# Altium project LED_Music.PrjPcb
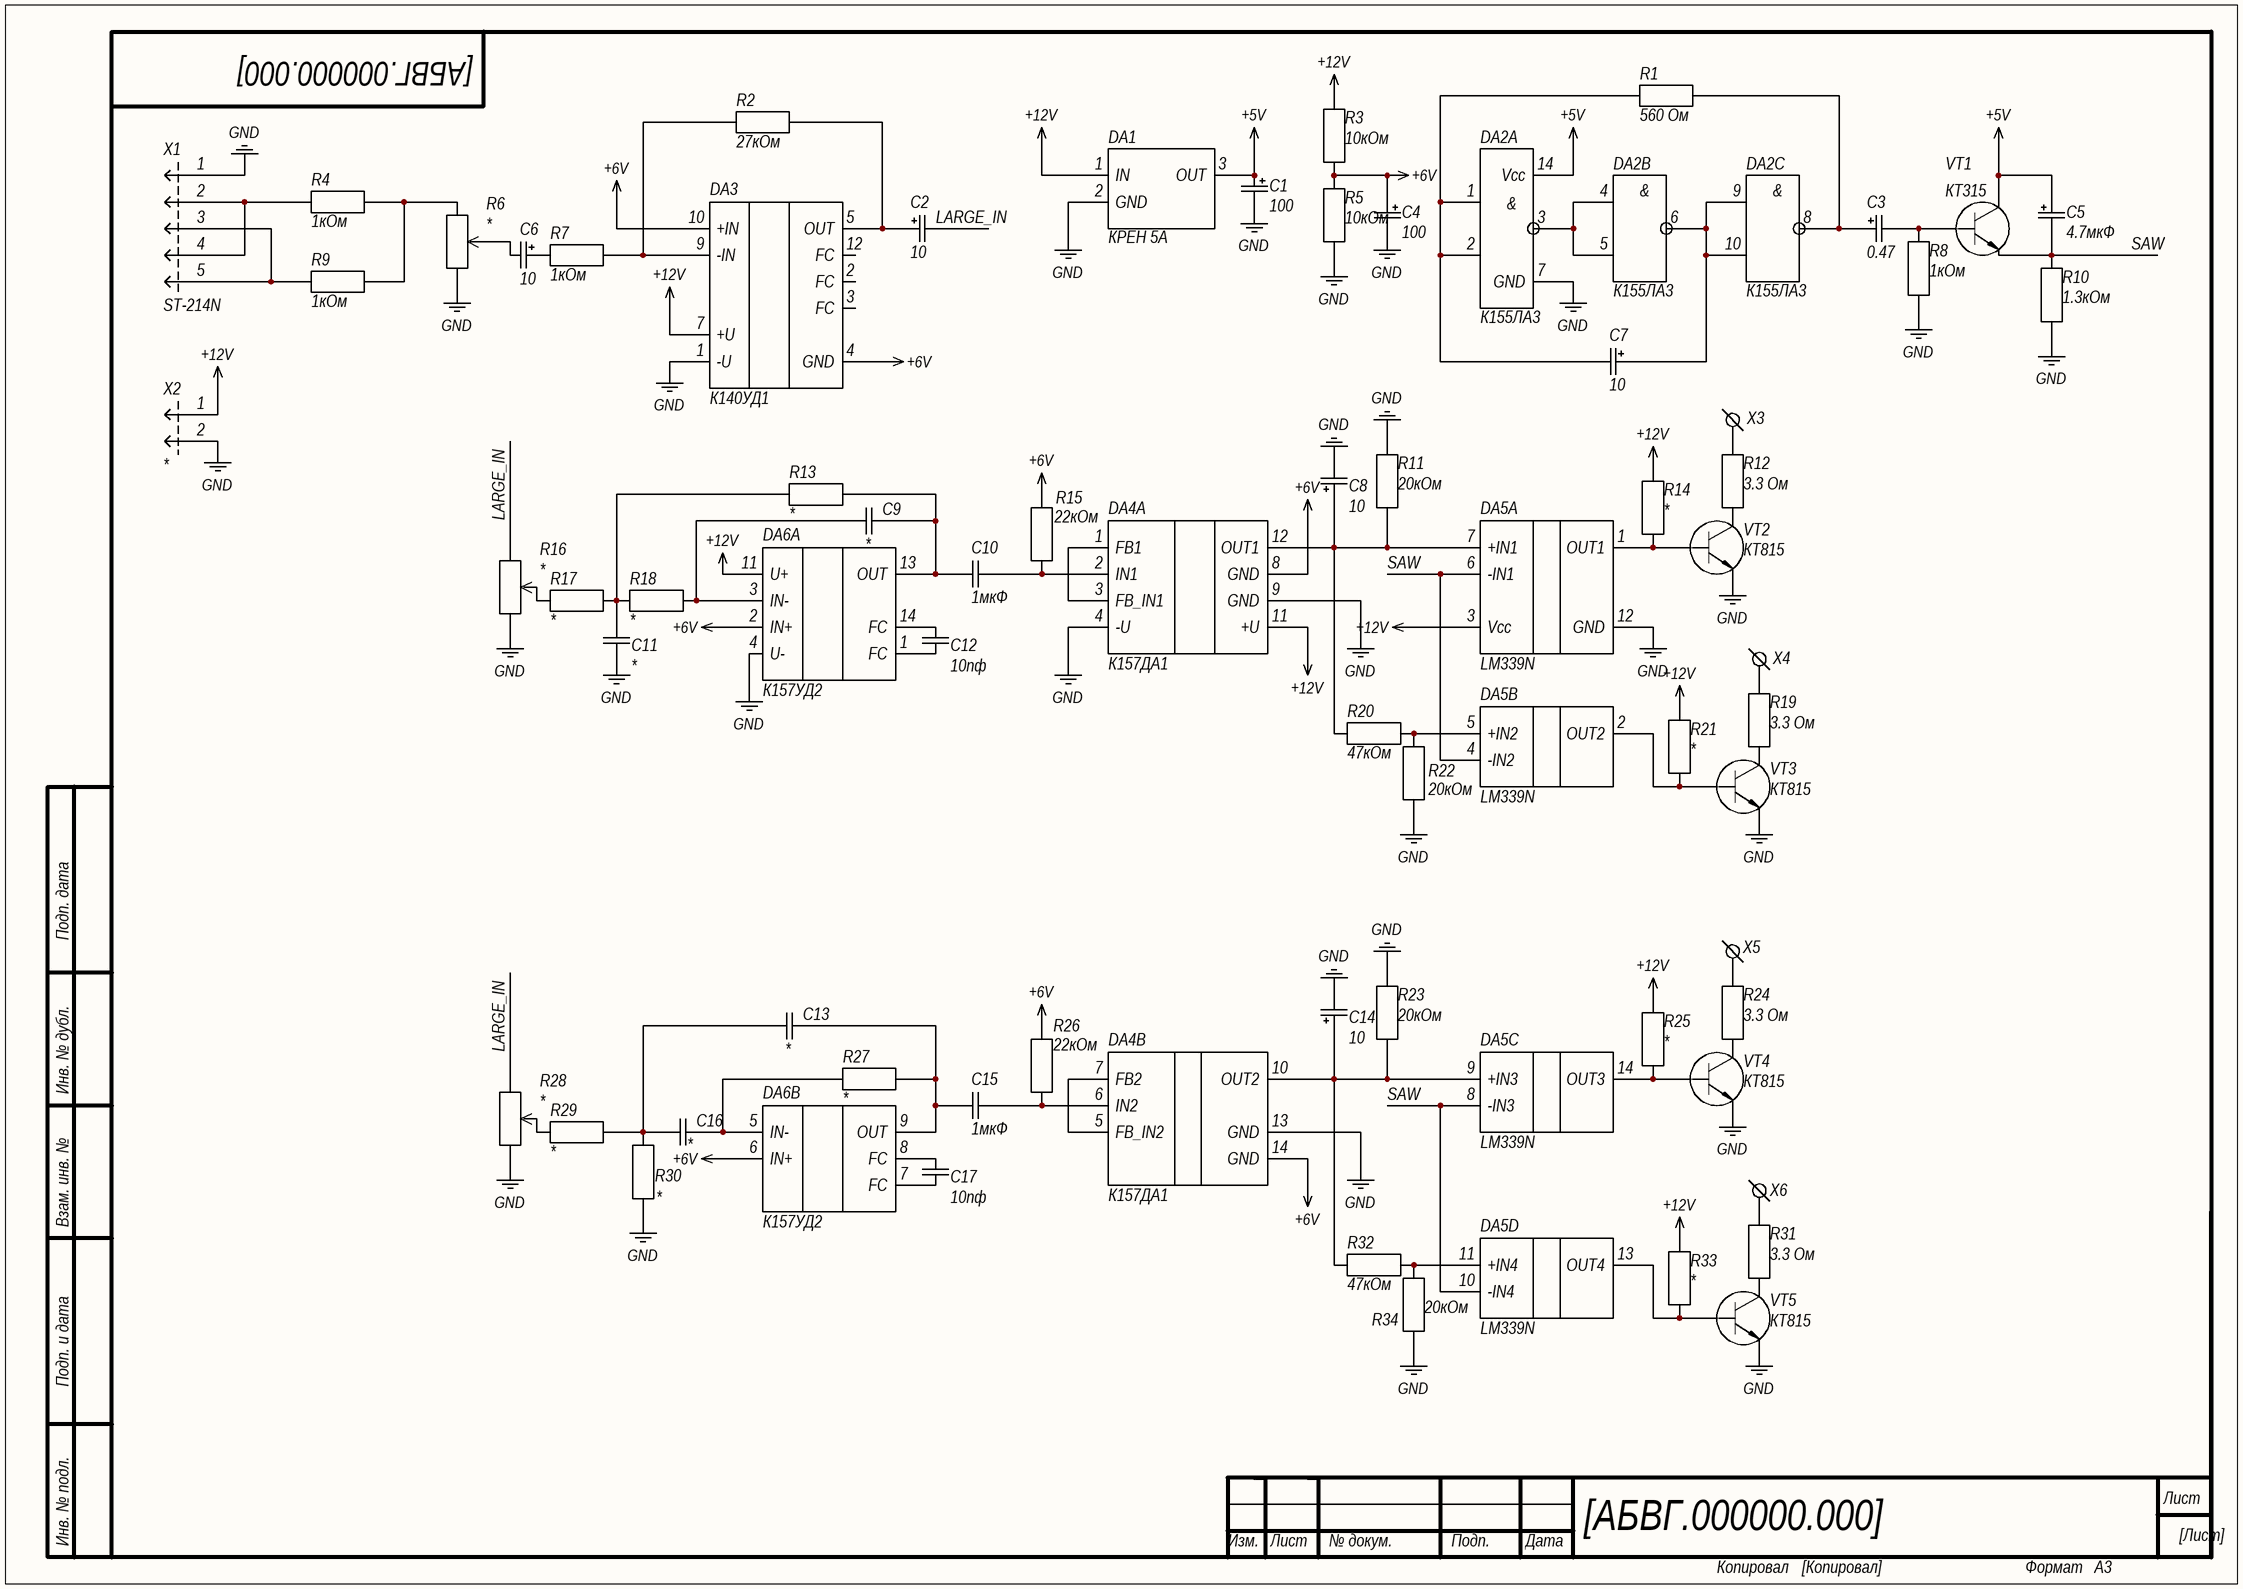
[diagram p0: Sheet1.SchDoc]
2 sheets, 113 parts. Net scope: global (net labels, ports and power ports of the same name join across sheets).
Board file: PCB1.PcbDoc
Sheets:
  Sheet1.SchDoc
  Sheet2.SchDoc

## Sheet Sheet1.SchDoc: [Название]
size 420 x 297 mm; ApprovedBy: [Утвердил]; CheckedBy: [Пров.]; Author: [Разраб.]; CompanyName: [Компания]; DocumentNumber: [АБВГ.000000.000]; SheetNumber: [Лист]; SheetTotal: [Листов]; ProcessInspection: [Т. контр.]; NormInspection: [Н. контр.]; firstReference: [Перв. применение]; CopiedBy: [Копировал]

### Parts
C1  100  [C 3.5mm]
C2  10  [C 3.5mm]
C3  0.47  [C 3.5mm]
C4  100  [C 3.5mm]
C5  4.7мкФ  [C 3.5mm]
C6  10  [C 3.5mm]
C7  10  [C 3.5mm]
C8  10  [C 3.5mm]
C9  *  [C 15mm]
C10  1мкФ  [C 10mm]
C11  *  [C 15mm]
C12  10пф  [C 10mm]
C13  *  [C 15mm]
C14  10  [C 3.5mm]
C15  1мкФ  [C 10mm]
C16  *  [C 15mm]
C17  10пф  [C 10mm]
DA1  КРЕН 5А  [TO-220]
DA2  К155ЛА3  [14-LEAD DIP]  (parts A,B,C of 4)
DA3  К140УД1  [301.12-1]
DA4  К157ДА1  [14-LEAD DIP]  (parts A,B of 2)
DA5  LM339N  [14-LEAD DIP]  (parts A,B,C,D of 4)
DA6  К157УД2  [14-LEAD DIP]  (parts A,B of 2)
R1  560 Ом  [R 10mm]
R2  27кОм  [R 10mm]
R3  10кОм  [R 10mm]
R4  1кОм  [R 10mm]
R5  10кОм  [R 10mm]
R6  *  [OFF BOARD RESISTOR]
R7  1кОм  [R 10mm]
R8  1кОм  [R 10mm]
R9  1кОм  [R 10mm]
R10  1.3кОм  [R 10mm]
R11  20кОм  [R 10mm]
R12  3.3 Ом  [R 10mm]
R13  *  [R 10mm]
R14  *  [R 10mm]
R15  22кОм  [R 10mm]
R16  *  [OFF BOARD RESISTOR]
R17  *  [R 10mm]
R18  *  [R 10mm]
R19  3.3 Ом  [R 10mm]
R20  47кОм  [R 10mm]
R21  *  [R 10mm]
R22  20кОм  [R 10mm]
R23  20кОм  [R 10mm]
R24  3.3 Ом  [R 10mm]
R25  *  [R 10mm]
R26  22кОм  [R 10mm]
R27  *  [R 10mm]
R28  *  [OFF BOARD RESISTOR]
R29  *  [R 10mm]
R30  *  [R 10mm]
R31  3.3 Ом  [R 10mm]
R32  47кОм  [R 10mm]
R33  *  [R 10mm]
R34  20кОм  [R 10mm]
VT1  КТ315  [KT-13]
VT2  КТ815  [KT-27]
VT3  КТ815  [KT-27]
VT4  КТ815  [KT-27]
VT5  КТ815  [KT-27]
X1  ST-214N  [ST-214N]
X2  *  [PLS-2]
X3  (no value)  [TP 1,4mm]
X4  (no value)  [TP 1,4mm]
X5  (no value)  [TP 1,4mm]
X6  (no value)  [TP 1,4mm]

### Nets
+5V: C1.1 C5.1 DA1.3(OUT) DA2.14(Vcc) VT1.3
+6V: C4.1 DA3.4(GND) DA3.10(+IN) DA4.8(GND) DA4.14(GND) DA6.2(IN+) DA6.6(IN+) R3.1 R5.2 R15.2 R26.2
+12V: DA1.1(IN) DA3.7(+U) DA4.11(+U) DA5.3(Vcc) DA6.11(U+) R3.2 R14.2 R21.2 R25.2 R33.2 X2.1
GND: C1.2 C4.2 C8.2 C11.1 C14.2 DA1.2(GND) DA2.7(GND) DA3.1(-U) DA4.4(-U) DA4.9(GND) DA4.13(GND) DA5.12(GND) DA6.4(U-) R5.1 R6.1 R8.1 R10.1 R11.2 R16.2 R22.1 R23.2 R28.2 R30.1 R34.1 VT2.2 VT3.2 VT4.2 VT5.2 X1.1 X2.2
LARGE_IN: C2.2 R16.1 R28.1
SAW: C5.2 DA5.4(-IN2) DA5.6(-IN1) DA5.8(-IN3) DA5.10(-IN4) R10.2 VT1.2
NetC2_1: C2.1 DA3.5(OUT) R2.2
NetC3_1: C3.1 DA2.8 R1.2
NetC3_2: C3.2 R8.2 VT1.1
NetC6_1: C6.1 R7.1
NetC6_2: C6.2 R6.3
NetC7_1: C7.1 DA2.6 DA2.9 DA2.10
NetC7_2: C7.2 DA2.1 DA2.2 R1.1
NetC8_1: C8.1 DA4.12(OUT1) DA5.7(+IN1) R11.1 R20.1
NetC9_1: C9.1 DA6.3(IN-) R18.2
NetC9_2: C9.2 C10.1 DA6.13(OUT) R13.1
NetC10_2: C10.2 DA4.2(IN1) R15.1
NetC11_2: C11.2 R13.2 R17.2 R18.1
NetC12_1: C12.1 DA6.1(FC)
NetC12_2: C12.2 DA6.14(FC)
NetC13_1: C13.1 C16.1 R29.2 R30.2
NetC13_2: C13.2 C15.1 DA6.9(OUT) R27.1
NetC14_1: C14.1 DA4.10(OUT2) DA5.9(+IN3) R23.1 R32.1
NetC15_2: C15.2 DA4.6(IN2) R26.1
NetC16_2: C16.2 DA6.5(IN-) R27.2
NetC17_1: C17.1 DA6.7(FC)
NetC17_2: C17.2 DA6.8(FC)
NetDA2_3: DA2.3 DA2.4 DA2.5
NetDA3_9: DA3.9(-IN) R2.1 R7.2
NetDA4_1: DA4.1(FB1) DA4.3(FB_IN1)
NetDA4_5: DA4.5(FB_IN2) DA4.7(FB2)
NetDA5_1: DA5.1(OUT1) R14.1 VT2.1
NetDA5_2: DA5.2(OUT2) R21.1 VT3.1
NetDA5_5: DA5.5(+IN2) R20.2 R22.2
NetDA5_11: DA5.11(+IN4) R32.2 R34.2
NetDA5_13: DA5.13(OUT4) R33.1 VT5.1
NetDA5_14: DA5.14(OUT3) R25.1 VT4.1
NetR4_1: R4.1 X1.2 X1.4
NetR4_2: R4.2 R6.2 R9.2
NetR9_1: R9.1 X1.3 X1.5
NetR12_1: R12.1 VT2.3
NetR12_2: R12.2 X3.1
NetR16_3: R16.3 R17.1
NetR19_1: R19.1 VT3.3
NetR19_2: R19.2 X4.1
NetR24_1: R24.1 VT4.3
NetR24_2: R24.2 X5.1
NetR28_3: R28.3 R29.1
NetR31_1: R31.1 VT5.3
NetR31_2: R31.2 X6.1

Not connected (* = marked no-connect by the designer): DA3 2(FC) 3(FC) 12(FC)

### Notes on the sheet
- Подп. дата
- Инв. № дубл.
- Взам. инв. №
- Подп. и дата
- Инв. № подл.
- Лист
- Изм.
- № докум.
- Подп.
- Дата
- Копировал
- Формат
- А3
- (in symbol К155ЛА3, part A) &
- (in symbol К155ЛА3, part B) &
- (in symbol К155ЛА3, part C) &

### Library data of the parts
C1-C8 C14 = Capacitor Pol: Value1: *; Manufacturer: *; ТУ: *; Url: *
  C1 C4: Value: 100
  C2 C6-C8 C14: Value: 10
  C3: Value: 0.47
  C5: Value: 4.7мкФ
C9-C13 C15-C17 = Capacitor: Value1: *; ТУ: *; Url: *
  C9 C11 C13 C16: Value: *
  C10 C15: Value: 1мкФ
  C12 C17: Value: 10пф
DA1 = KREN 5A: value: КРЕН 5А
R1-R5 R7-R15 R17-R27 R29-R34 = Resistor: Value1: *; ТУ: *; Manufacturer: *; Url: *
  R1: Value: 560 Ом
  R2: Value: 27кОм
  R3 R5: Value: 10кОм
  R4 R7-R9: Value: 1кОм
  R10: Value: 1.3кОм
  R11 R22 R23 R34: Value: 20кОм
  R12 R19 R24 R31: Value: 3.3 Ом
  R13 R14 R17 R18 R21 R25 R27 R29 R30 R33: Value: *
  R15 R26: Value: 22кОм
  R20 R32: Value: 47кОм
R6 R16 R28 = ResistorVar: Value: *; Value1: *; ТУ: *; Url: *; Manufacturer: *
VT1-VT5 = NPN: Transistor; Value1: *; ТУ: *; Manufacturer: *; Url: *
  VT1: Value: КТ315
  VT2-VT5: Value: КТ815
X1 = ST-214N: Connector; value: ST-214N
X2 = Connector 2-pin: Connector; Manufacturer: *; PartNumber: *; Value: *; Value1: *
X3-X6 = TP
DA2 = К155ЛА3: value: К155ЛА3
DA3 = К140УД1: value: К140УД1
DA4 = К157ДА1: value: К157ДА1
DA5 = LM339N: value: LM339N
DA6 = К157УД2: value: К157УД2

## Sheet Sheet2.SchDoc: [Название]
size 420 x 297 mm; ApprovedBy: [Утвердил]; CheckedBy: [Пров.]; Author: [Разраб.]; CompanyName: [Компания]; DocumentNumber: [АБВГ.000000.000]; SheetNumber: [Лист]; SheetTotal: [Листов]; ProcessInspection: [Т. контр.]; NormInspection: [Н. контр.]; firstReference: [Перв. применение]; CopiedBy: [Копировал]
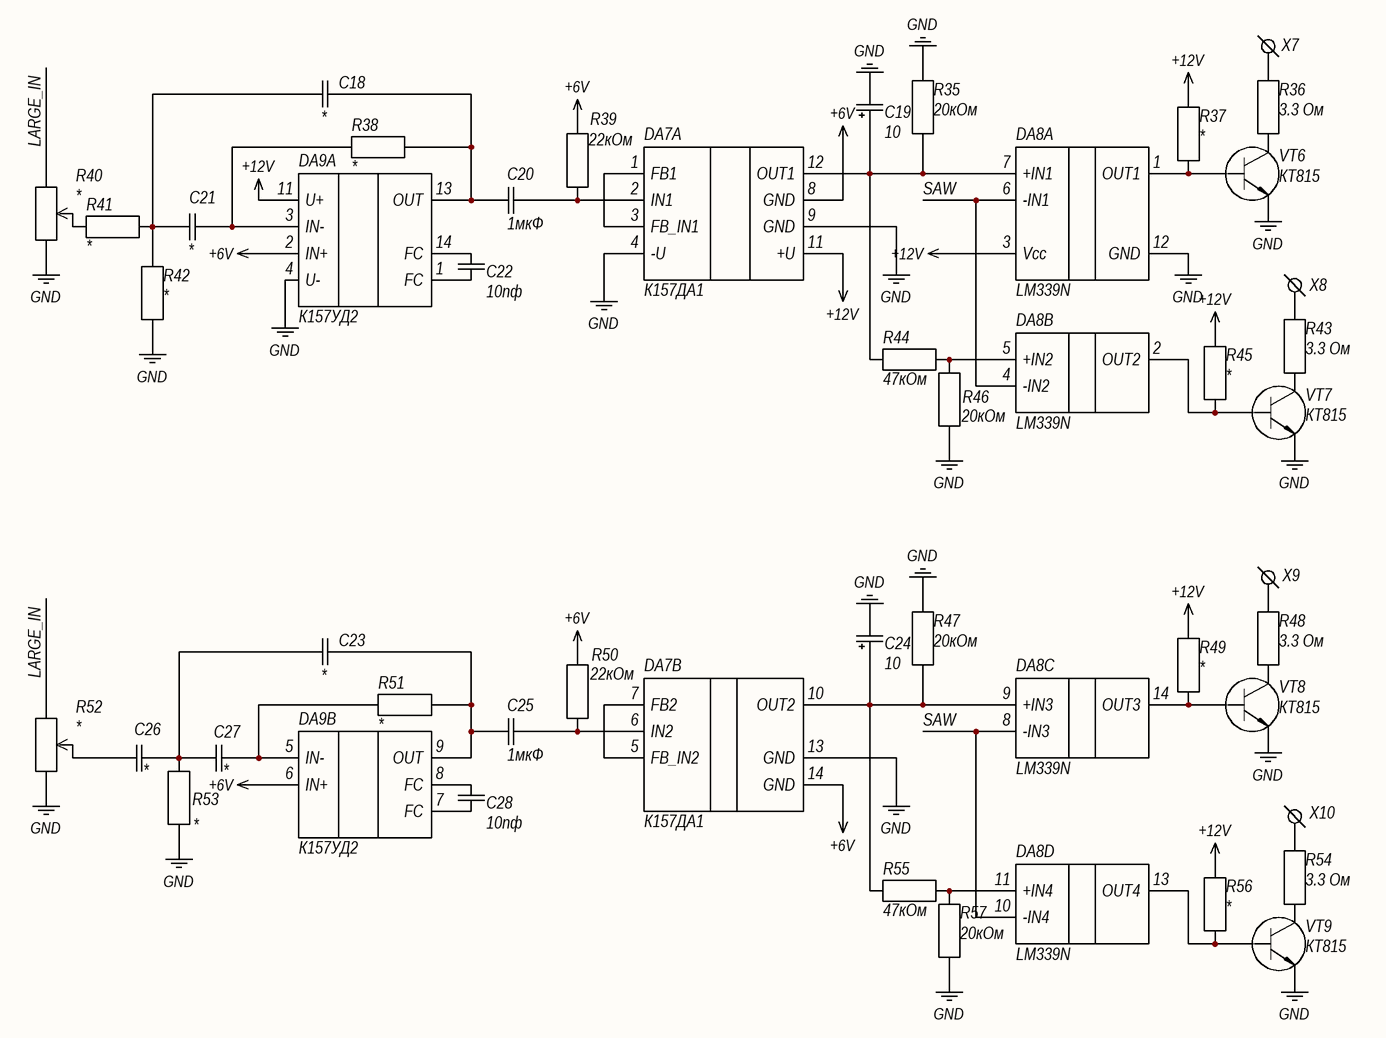
[diagram p1: Sheet2.SchDoc]

### Parts
C18  *  [C 15mm]
C19  10  [C 3.5mm]
C20  1мкФ  [C 10mm]
C21  *  [C 15mm]
C22  10пф  [C 10mm]
C23  *  [C 15mm]
C24  10  [C 3.5mm]
C25  1мкФ  [C 10mm]
C26  *  [C 15mm]
C27  *  [C 15mm]
C28  10пф  [C 10mm]
DA7  К157ДА1  [14-LEAD DIP]  (parts A,B of 2)
DA8  LM339N  [14-LEAD DIP]  (parts A,B,C,D of 4)
DA9  К157УД2  [14-LEAD DIP]  (parts A,B of 2)
R35  20кОм  [R 10mm]
R36  3.3 Ом  [R 10mm]
R37  *  [R 10mm]
R38  *  [R 10mm]
R39  22кОм  [R 10mm]
R40  *  [OFF BOARD RESISTOR]
R41  *  [R 10mm]
R42  *  [R 10mm]
R43  3.3 Ом  [R 10mm]
R44  47кОм  [R 10mm]
R45  *  [R 10mm]
R46  20кОм  [R 10mm]
R47  20кОм  [R 10mm]
R48  3.3 Ом  [R 10mm]
R49  *  [R 10mm]
R50  22кОм  [R 10mm]
R51  *  [R 10mm]
R52  *  [OFF BOARD RESISTOR]
R53  *  [R 10mm]
R54  3.3 Ом  [R 10mm]
R55  47кОм  [R 10mm]
R56  *  [R 10mm]
R57  20кОм  [R 10mm]
VT6  КТ815  [KT-27]
VT7  КТ815  [KT-27]
VT8  КТ815  [KT-27]
VT9  КТ815  [KT-27]
X7  (no value)  [TP 1,4mm]
X8  (no value)  [TP 1,4mm]
X9  (no value)  [TP 1,4mm]
X10  (no value)  [TP 1,4mm]

### Nets
+6V: DA7.8(GND) DA7.14(GND) DA9.2(IN+) DA9.6(IN+) R39.2 R50.2
+12V: DA7.11(+U) DA8.3(Vcc) DA9.11(U+) R37.2 R45.2 R49.2 R56.2
GND: C19.2 C24.2 DA7.4(-U) DA7.9(GND) DA7.13(GND) DA8.12(GND) DA9.4(U-) R35.2 R40.2 R42.1 R46.1 R47.2 R52.2 R53.1 R57.1 VT6.2 VT7.2 VT8.2 VT9.2
LARGE_IN: R40.1 R52.1
SAW: DA8.4(-IN2) DA8.6(-IN1) DA8.8(-IN3) DA8.10(-IN4)
NetC18_1: C18.1 C21.1 R41.2 R42.2
NetC18_2: C18.2 C20.1 DA9.13(OUT) R38.1
NetC19_1: C19.1 DA7.12(OUT1) DA8.7(+IN1) R35.1 R44.1
NetC20_2: C20.2 DA7.2(IN1) R39.1
NetC21_2: C21.2 DA9.3(IN-) R38.2
NetC22_1: C22.1 DA9.1(FC)
NetC22_2: C22.2 DA9.14(FC)
NetC23_1: C23.1 C26.2 C27.1 R53.2
NetC23_2: C23.2 C25.1 DA9.9(OUT) R51.1
NetC24_1: C24.1 DA7.10(OUT2) DA8.9(+IN3) R47.1 R55.1
NetC25_2: C25.2 DA7.6(IN2) R50.1
NetC26_1: C26.1 R52.3
NetC27_2: C27.2 DA9.5(IN-) R51.2
NetC28_1: C28.1 DA9.7(FC)
NetC28_2: C28.2 DA9.8(FC)
NetDA7_1: DA7.1(FB1) DA7.3(FB_IN1)
NetDA7_5: DA7.5(FB_IN2) DA7.7(FB2)
NetDA8_1: DA8.1(OUT1) R37.1 VT6.1
NetDA8_2: DA8.2(OUT2) R45.1 VT7.1
NetDA8_5: DA8.5(+IN2) R44.2 R46.2
NetDA8_11: DA8.11(+IN4) R55.2 R57.2
NetDA8_13: DA8.13(OUT4) R56.1 VT9.1
NetDA8_14: DA8.14(OUT3) R49.1 VT8.1
NetR36_1: R36.1 VT6.3
NetR36_2: R36.2 X7.1
NetR40_3: R40.3 R41.1
NetR43_1: R43.1 VT7.3
NetR43_2: R43.2 X8.1
NetR48_1: R48.1 VT8.3
NetR48_2: R48.2 X9.1
NetR54_1: R54.1 VT9.3
NetR54_2: R54.2 X10.1

### Notes on the sheet
- Подп. дата
- Инв. № дубл.
- Взам. инв. №
- Подп. и дата
- Инв. № подл.
- Лист
- Изм.
- № докум.
- Подп.
- Дата
- Копировал
- Формат
- А3

### Library data of the parts
C18 C20-C23 C25-C28 = Capacitor: Value1: *; ТУ: *; Url: *
  C18 C21 C23 C26 C27: Value: *
  C20 C25: Value: 1мкФ
  C22 C28: Value: 10пф
C19 C24 = Capacitor Pol: Value: 10; Value1: *; Manufacturer: *; ТУ: *; Url: *
R35-R39 R41-R51 R53-R57 = Resistor: Value1: *; ТУ: *; Manufacturer: *; Url: *
  R35 R46 R47 R57: Value: 20кОм
  R36 R43 R48 R54: Value: 3.3 Ом
  R37 R38 R41 R42 R45 R49 R51 R53 R56: Value: *
  R39 R50: Value: 22кОм
  R44 R55: Value: 47кОм
R40 R52 = ResistorVar: Value: *; Value1: *; ТУ: *; Url: *; Manufacturer: *
VT6-VT9 = NPN: Transistor; Value: КТ815; Value1: *; ТУ: *; Manufacturer: *; Url: *
X7-X10 = TP
DA7 = К157ДА1: value: К157ДА1
DA8 = LM339N: value: LM339N
DA9 = К157УД2: value: К157УД2

## Nets that join several sheets
+6V: Sheet1 (11 pins), Sheet2 (6 pins)
+12V: Sheet1 (11 pins), Sheet2 (7 pins)
GND: Sheet1 (30 pins), Sheet2 (19 pins)
LARGE_IN: Sheet1 (C2.2 R16.1 R28.1), Sheet2 (R40.1 R52.1)
SAW: Sheet1 (7 pins), Sheet2 (DA8.4 DA8.6 DA8.8 DA8.10)